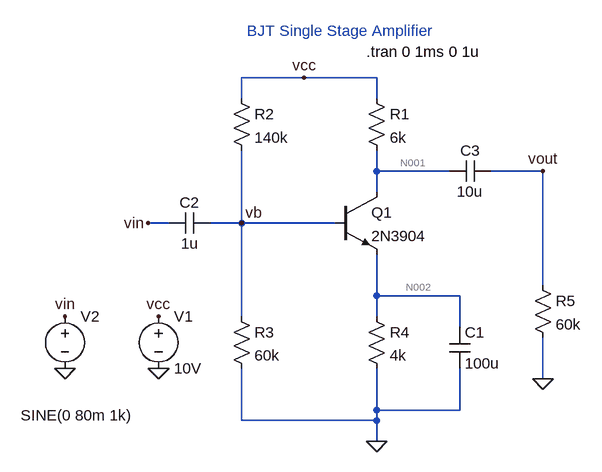
[diagram p0: schematic bjt_02.asc]
bjt_02.asc, the LTspice schematic file:
Version 4.1
SHEET 1 880 680
WIRE 384 -112 288 -112
WIRE 496 -112 384 -112
WIRE 288 -80 288 -112
WIRE 496 -80 496 -112
WIRE 496 32 496 0
WIRE 608 32 496 32
WIRE 752 32 672 32
WIRE 496 64 496 32
WIRE 176 112 144 112
WIRE 288 112 288 0
WIRE 288 112 240 112
WIRE 432 112 288 112
WIRE 752 208 752 32
WIRE 496 224 496 160
WIRE 624 224 496 224
WIRE 288 256 288 112
WIRE 496 256 496 224
WIRE 624 272 624 224
WIRE 752 352 752 288
WIRE 496 400 496 336
WIRE 624 400 624 336
WIRE 624 400 496 400
WIRE 288 416 288 336
WIRE 496 416 496 400
WIRE 496 416 288 416
WIRE 496 448 496 416
FLAG 160 256 vcc
FLAG 160 336 0
FLAG 752 352 0
FLAG 384 -112 vcc
FLAG 144 112 vin
FLAG 496 448 0
FLAG 752 32 vout
FLAG 288 112 vb
FLAG 16 336 0
FLAG 16 256 vin
SYMBOL voltage 160 240 R0
WINDOW 123 0 0 Left 0
WINDOW 39 0 0 Left 0
SYMATTR InstName V1
SYMATTR Value 10V
SYMBOL res 480 -96 R0
SYMATTR InstName R1
SYMATTR Value 6k
SYMBOL res 272 -96 R0
SYMATTR InstName R2
SYMATTR Value 140k
SYMBOL res 272 240 R0
SYMATTR InstName R3
SYMATTR Value 60k
SYMBOL res 480 240 R0
SYMATTR InstName R4
SYMATTR Value 4k
SYMBOL cap 608 272 R0
SYMATTR InstName C1
SYMATTR Value 100u
SYMBOL cap 240 96 R90
WINDOW 0 0 32 VBottom 2
WINDOW 3 32 32 VTop 2
SYMATTR InstName C2
SYMATTR Value 1u
SYMBOL cap 672 16 R90
WINDOW 0 0 32 VBottom 2
WINDOW 3 32 32 VTop 2
SYMATTR InstName C3
SYMATTR Value 10u
SYMBOL res 736 192 R0
SYMATTR InstName R5
SYMATTR Value 60k
SYMBOL voltage 16 240 R0
WINDOW 3 -68 168 Left 2
WINDOW 123 0 0 Left 0
WINDOW 39 0 0 Left 0
SYMATTR InstName V2
SYMATTR Value SINE(0 80m 1k)
SYMBOL npn 432 64 R0
SYMATTR InstName Q1
SYMATTR Value 2N3904
TEXT 296 -184 Left 2 ;BJT Single Stage Amplifier
TEXT 480 -152 Left 2 !.tran 0 1ms 0 1u

The netlist it stands for:
* bjt_02.asc
V1 vcc 0 10V
R1 vcc N001 6k
R2 vcc vb 140k
R3 vb 0 60k
R4 N002 0 4k
C1 N002 0 100u
C2 vb vin 1u
C3 vout N001 10u
R5 vout 0 60k
V2 vin 0 SINE(0 80m 1k)
Q1 N001 vb N002 0 2N3904
.model NPN NPN
.model PNP PNP
.lib standard.bjt
* BJT Single Stage Amplifier
.tran 0 1ms 0 1u
.backanno
.end

* Results of the author's LTspice run, read from the files saved beside the schematic
* Operating Point, zero values left out:
*   V(n001) = 6.586 V
*   V(n002) = 2.283 V
*   V(vcc) = 10 V
*   V(vb) = 2.923 V
*   I(V1) = -619.5 µA
*   I(R2) = 50.55 µA
*   I(R4) = 570.8 µA
*   Ic(Q1) = 569 µA
*   Ib(Q1) = 1.832 µA
*   Ie(Q1) = -570.8 µA
*   I(R3) = 48.72 µA
*   I(R1) = 569 µA
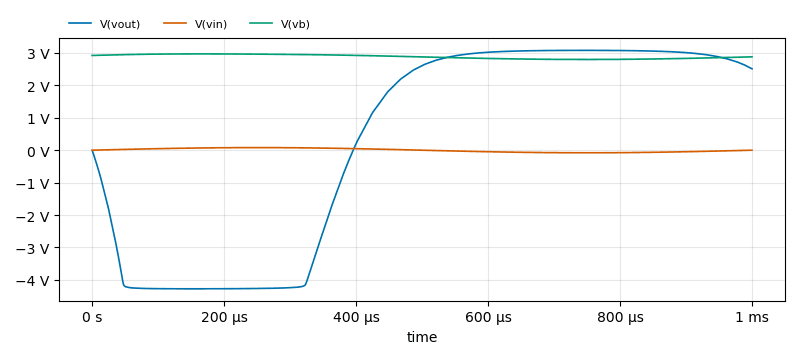
[diagram p1: Transient Analysis of bjt_02.asc, plotted from the saved traces]
* Transient Analysis, 1 run:
*   V(vout): min -4.276 V, max 3.08 V, average 252.8 mV, rms 3.23 V, last 2.51 V
*   V(vin): min -79.98 mV, max 79.99 mV, average 19.43 µV, rms 56.49 mV, last 0 V
*   V(vb): min 2.799 V, max 2.97 V, average 2.886 V, rms 2.887 V, last 2.879 V